# Altium schematic sheet ADC108S022_PINOUT.SchDoc
size A; SheetNumber: 8; SheetTotal: 17
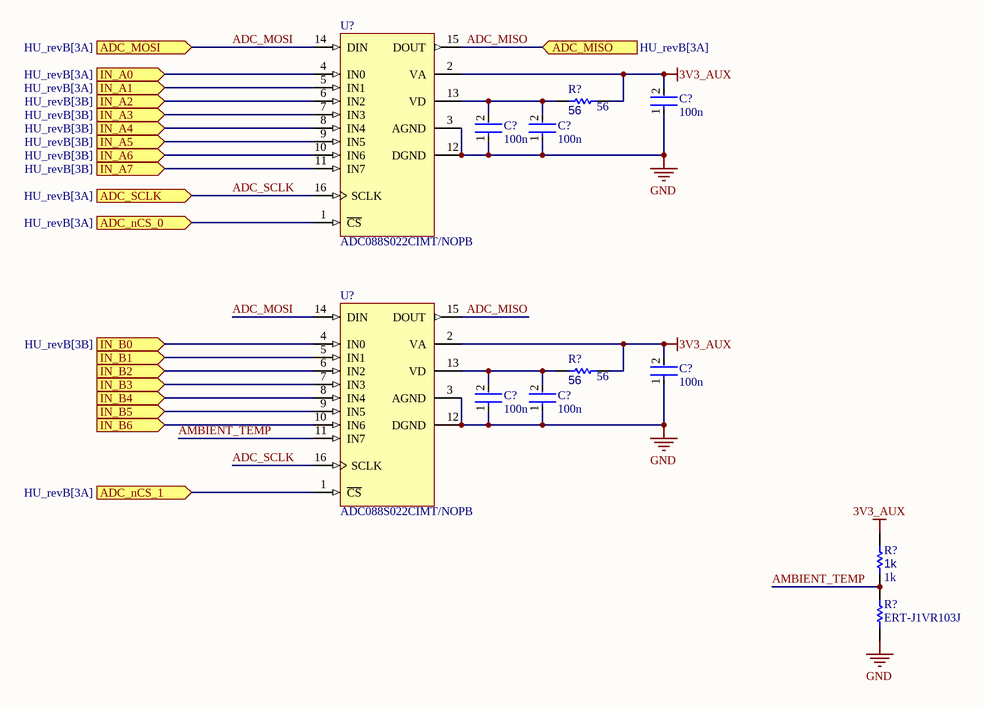
[diagram p0: ADC108S022_PINOUT.SchDoc]

## Parts
(Parts that share a designator on the sheet are numbered #1, #2 ... from top to bottom, then left to right.)
C?#1  100n  [FP-0402-L_1_0_0_05-W_0_5-IPC_A]
C?#2  100n  [FP-0402-L_1_0_0_05-W_0_5-IPC_A]
C?#3  100n  [FP-0402-L_1_0_0_05-W_0_5-IPC_A]
C?#4  100n  [FP-0402-L_1_0_0_05-W_0_5-IPC_A]
C?#5  100n  [FP-0402-L_1_0_0_05-W_0_5-IPC_A]
C?#6  100n  [FP-0402-L_1_0_0_05-W_0_5-IPC_A]
R?#1  56  [R0603B]
R?#2  56  [R0603B]
R?#3  1k  [R0603B]
R?#4  ERT-J1VR103J  [RESC1608X90X30ML15T20]
U?#1  ADC088S022CIMT/NOPB  [MTC16_L]
U?#2  ADC088S022CIMT/NOPB  [MTC16_L]

## Ports
ADC_MISO (in, see HU_revB[3A]), ADC_MOSI (in, see HU_revB[3A]), ADC_nCS_0 (in, see HU_revB[3A]), ADC_nCS_1 (in, see HU_revB[3A]), ADC_SCLK (in, see HU_revB[3A]), IN_A0 (in, see HU_revB[3A]), IN_A1 (in, see HU_revB[3A]), IN_A2 (in, see HU_revB[3B]), IN_A3 (in, see HU_revB[3B]), IN_A4 (in, see HU_revB[3B]), IN_A5 (in, see HU_revB[3B]), IN_A6 (in, see HU_revB[3B]), IN_A7 (in, see HU_revB[3B]), IN_B0 (in, see HU_revB[3B]), IN_B1 (in), IN_B2 (in), IN_B3 (in), IN_B4 (in), IN_B5 (in), IN_B6 (in)

## Nets
3V3_AUX: C?#1.2 C?#4.2 R?#1.1 R?#2.1 R?#3.1 U?#1.2(VA) U?#2.2(VA)
GND: C?#1.1 C?#2.1 C?#3.1 C?#4.1 C?#5.1 C?#6.1 R?#4.1 U?#1.3(AGND) U?#1.12(DGND) U?#2.3(AGND) U?#2.12(DGND)
ADC_MISO: U?#1.15(DOUT) U?#2.15(DOUT) ; port ADC_MISO
ADC_MOSI: U?#1.14(DIN) U?#2.14(DIN) ; port ADC_MOSI
ADC_nCS_0: U?#1.1(~{CS}) ; port ADC_nCS_0
ADC_nCS_1: U?#2.1(~{CS}) ; port ADC_nCS_1
ADC_SCLK: U?#1.16(SCLK) U?#2.16(SCLK) ; port ADC_SCLK
AMBIENT_TEMP: R?#3.2 R?#4.2 U?#2.11(IN7)
IN_A0: U?#1.4(IN0) ; port IN_A0
IN_A1: U?#1.5(IN1) ; port IN_A1
IN_A2: U?#1.6(IN2) ; port IN_A2
IN_A3: U?#1.7(IN3) ; port IN_A3
IN_A4: U?#1.8(IN4) ; port IN_A4
IN_A5: U?#1.9(IN5) ; port IN_A5
IN_A6: U?#1.10(IN6) ; port IN_A6
IN_A7: U?#1.11(IN7) ; port IN_A7
IN_B0: U?#2.4(IN0) ; port IN_B0
IN_B1: U?#2.5(IN1) ; port IN_B1
IN_B2: U?#2.6(IN2) ; port IN_B2
IN_B3: U?#2.7(IN3) ; port IN_B3
IN_B4: U?#2.8(IN4) ; port IN_B4
IN_B5: U?#2.9(IN5) ; port IN_B5
IN_B6: U?#2.10(IN6) ; port IN_B6
NetC?#2_2: C?#2.2 C?#3.2 R?#1.2 U?#1.13(VD)
NetC?#5_2: C?#5.2 C?#6.2 R?#2.2 U?#2.13(VD)

## Library data of the parts
C?#1-C?#6 = CMP-001-00058-1: LARGE PADS, 0402 CAP, CHANGE COMMENT TO MATCH REAL P/N; Capacitor Type: Ceramic; Min Operating Temperature: -55°C; Mounting Technology: Surface Mount; Pins: 2; Case/Package: 0402; RoHS Compliant: Yes; Max Operating Temperature: 85°C
R?#1-R?#3 = CMP-009-00002-14: Resistor
  R?#1 R?#2: Value: 56
  R?#3: Value: 1k
R?#4 = CMP-2000-00869-1: Manufacturer: Panasonic; Part Number: ERT-J1VR103J
U?#1 U?#2 = CMP-0054-00372-2: 8-Channel, 50 kSPS to 200 kSPS, 8-Bit A/D Converter, 16-pin TSSOP, Pb-Free; Manufacturer: National Semiconductor; PackageTopMarking: NSUZXYTT*88S022*CIMT; CompType: ADC IC; PowerWise: Y; ComponentLink2URL: http://www.national.com/pf/AD/ADC088S022.html; RoHS: Y; PackageDescription: Molded TSSOP, Jedec, 5 x 4.4 x 0.9mm Body, 16 Lead, 0.65mm Pitch; DatasheetVersion: Feb-2010; PinCount: 16; ComponentLink1Description: ADC088S022 Datasheet; Code_JEDEC: MO-153-AB; ComponentLink3URL: http://www.national.com/packaging/folders/mtc16.html; PackageVersion: revD, Jun-2003; ComponentLink3Description: MTC16 Package Page; RevisionNote: Component URLs added; ComponentLink1URL: http://www.national.com/ds/AD/ADC088S022.pdf; ComponentLink2Description: ADC088S022 Web Page; PackageReference: MTC16